# EAGLE design HOMADOS_v1 (EAGLE 9.6.2)
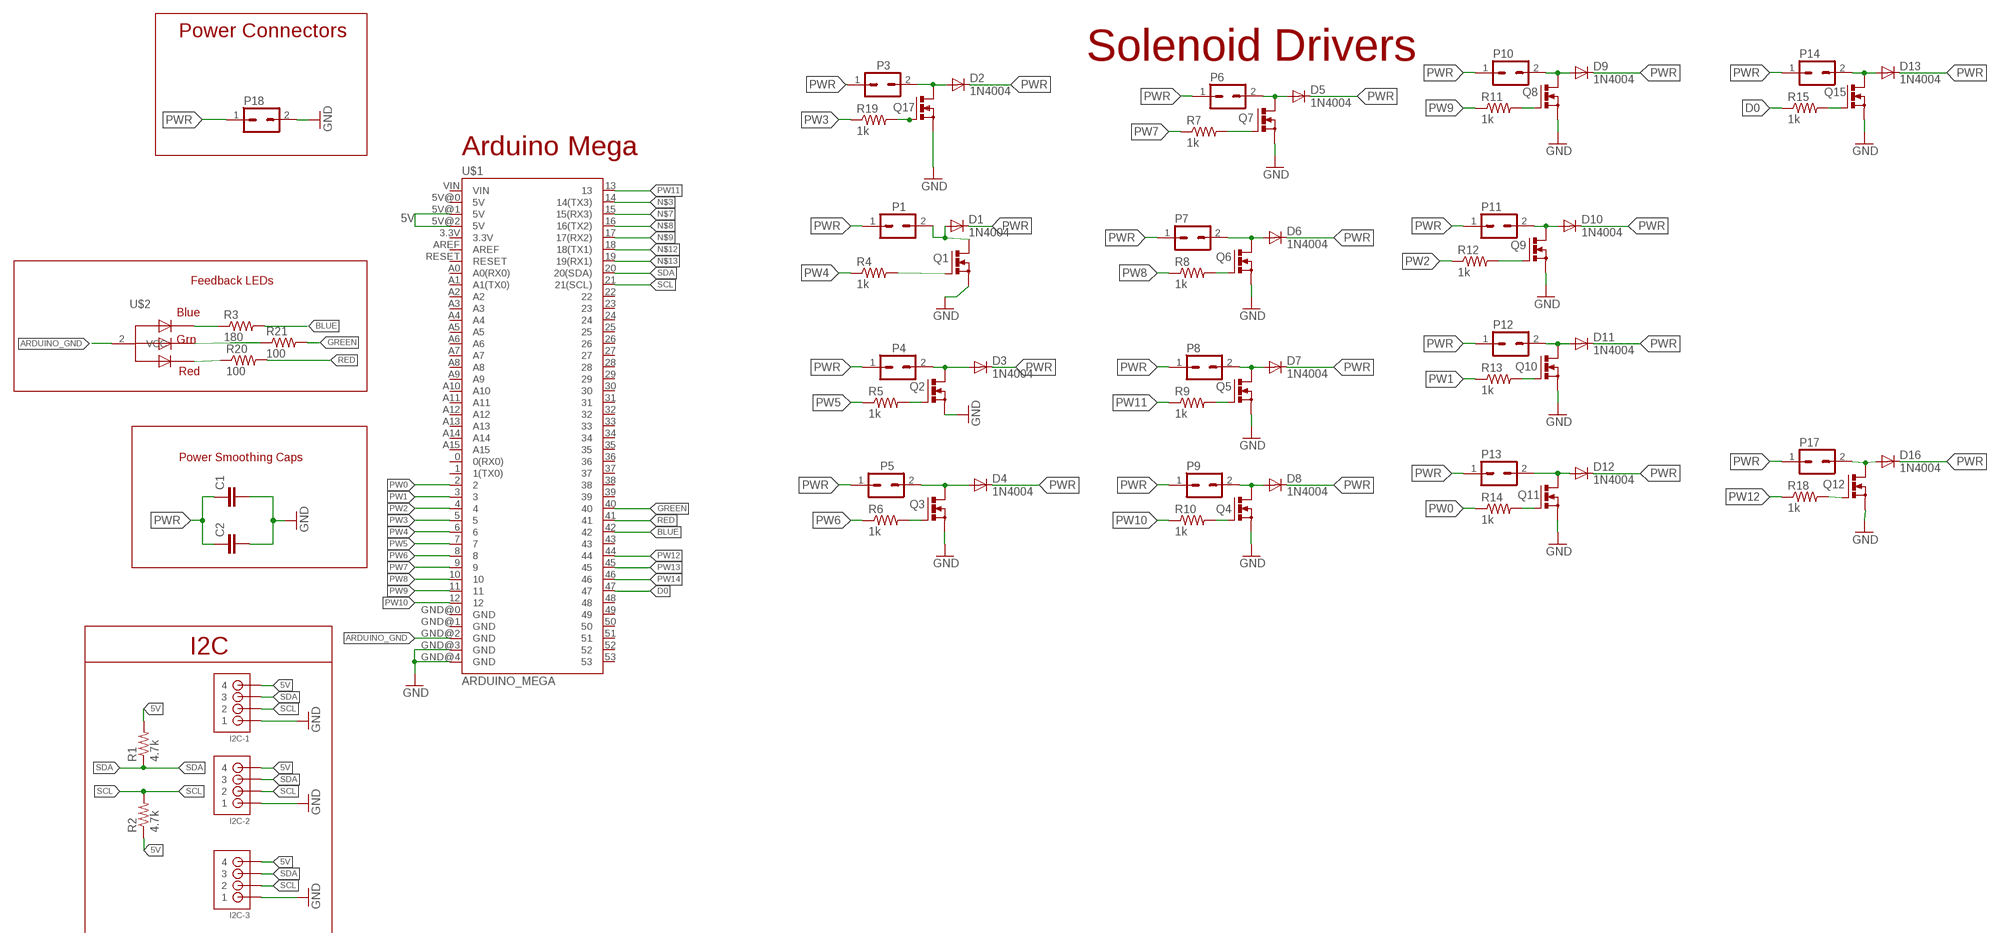
[diagram p0: schematic, sheet 1]

## Parts
C1  CAPPTH1  [CAP-PTH-5MM]
C2  CAPPTH3  [CAP-PTH-LARGE]
D1  1N4004  [DO41-10]
D2  1N4004  [DO41-10]
D3  1N4004  [DO41-10]
D4  1N4004  [DO41-10]
D5  1N4004  [DO41-10]
D6  1N4004  [DO41-10]
D7  1N4004  [DO41-10]
D8  1N4004  [DO41-10]
D9  1N4004  [DO41-10]
D10  1N4004  [DO41-10]
D11  1N4004  [DO41-10]
D12  1N4004  [DO41-10]
D13  1N4004  [DO41-10]
D16  1N4004  [DO41-10]
I2C-1  JST-PH_4-PIN_HEADER  [JST_B4B-PH_HEADER]
I2C-2  JST-PH_4-PIN_HEADER  [JST_B4B-PH_HEADER]
I2C-3  JST-PH_4-PIN_HEADER  [JST_B4B-PH_HEADER]
P1  39-30-02  [39-30-?02?]
P3  39-30-02  [39-30-?02?]
P4  39-30-02  [39-30-?02?]
P5  39-30-02  [39-30-?02?]
P6  39-30-02  [39-30-?02?]
P7  39-30-02  [39-30-?02?]
P8  39-30-02  [39-30-?02?]
P9  39-30-02  [39-30-?02?]
P10  39-30-02  [39-30-?02?]
P11  39-30-02  [39-30-?02?]
P12  39-30-02  [39-30-?02?]
P13  39-30-02  [39-30-?02?]
P14  39-30-02  [39-30-?02?]
P17  39-30-02  [39-30-?02?]
P18  39-30-02  [39-30-?02?]
Q1  PMOSFET_NTO220BV  [TO220BV]
Q2  PMOSFET_NTO220BV  [TO220BV]
Q3  PMOSFET_NTO220BV  [TO220BV]
Q4  PMOSFET_NTO220BV  [TO220BV]
Q5  PMOSFET_NTO220BV  [TO220BV]
Q6  PMOSFET_NTO220BV  [TO220BV]
Q7  PMOSFET_NTO220BV  [TO220BV]
Q8  PMOSFET_NTO220BV  [TO220BV]
Q9  PMOSFET_NTO220BV  [TO220BV]
Q10  PMOSFET_NTO220BV  [TO220BV]
Q11  PMOSFET_NTO220BV  [TO220BV]
Q12  PMOSFET_NTO220BV  [TO220BV]
Q15  PMOSFET_NTO220BV  [TO220BV]
Q17  PMOSFET_NTO220BV  [TO220BV]
R1  4.7k  RESISTORKIT  [AXIAL-0.3-KIT]
R2  4.7k  RESISTORKIT  [AXIAL-0.3-KIT]
R3  180  RESISTORKIT  [AXIAL-0.3-KIT]
R4  1k  RESISTORKIT  [AXIAL-0.3-KIT]
R5  1k  RESISTORKIT  [AXIAL-0.3-KIT]
R6  1k  RESISTORKIT  [AXIAL-0.3-KIT]
R7  1k  RESISTORKIT  [AXIAL-0.3-KIT]
R8  1k  RESISTORKIT  [AXIAL-0.3-KIT]
R9  1k  RESISTORKIT  [AXIAL-0.3-KIT]
R10  1k  RESISTORKIT  [AXIAL-0.3-KIT]
R11  1k  RESISTORKIT  [AXIAL-0.3-KIT]
R12  1k  RESISTORKIT  [AXIAL-0.3-KIT]
R13  1k  RESISTORKIT  [AXIAL-0.3-KIT]
R14  1k  RESISTORKIT  [AXIAL-0.3-KIT]
R15  1k  RESISTORKIT  [AXIAL-0.3-KIT]
R18  1k  RESISTORKIT  [AXIAL-0.3-KIT]
R19  1k  RESISTORKIT  [AXIAL-0.3-KIT]
R20  100  RESISTORKIT  [AXIAL-0.3-KIT]
R21  100  RESISTORKIT  [AXIAL-0.3-KIT]
U$1  ARDUINO_MEGA  [ARDUINO_MEGA]
U$2  RGBLED_CA  [LED5MMRGB]

## Nets
5V: I2C-1.P4 I2C-2.P4 I2C-3.P4 R1.P$2 R2.P$1 U$1.5V@1(5V) U$1.5V@2(5V)
A0: R3.P$1 U$2.4(BLUE)
A2: R20.P$1 U$2.1(RED)
ARDUINO_GND: U$1.GND@2(GND) U$2.2(VCC)
BLUE: R3.P$2 U$1.42
D0: R15.P$1 U$1.47
GND: C1.2 C2.2 I2C-1.P1 I2C-2.P1 I2C-3.P1 P18.2 Q1.S Q2.S Q3.S Q4.S Q5.S Q6.S Q7.S Q8.S Q9.S Q10.S Q11.S Q12.S Q15.S Q17.S U$1.GND@3(GND) U$1.GND@4(GND)
GREEN: R21.P$2 U$1.40
N$1: R21.P$1 U$2.3(GREEN)
N$2: D2.A P3.2 Q17.D
N$3: U$1.14(14(TX3))
N$4: D5.A P6.2 Q7.D
N$5: D12.A P13.2 Q11.D
N$6: Q17.G R19.P$2
N$7: U$1.15(15(RX3))
N$8: U$1.16(16(TX2))
N$9: U$1.17(17(RX2))
N$10: Q1.G R4.P$2
N$11: D13.A P14.2 Q15.D
N$12: U$1.18(18(TX1))
N$13: U$1.19(19(RX1))
N$14: Q2.G R5.P$2
N$15: D1.A P1.2 Q1.D
N$16: D3.A P4.2 Q2.D
N$18: Q3.G R6.P$2
N$19: D4.A P5.2 Q3.D
N$20: D6.A P7.2 Q6.D
N$21: D7.A P8.2 Q5.D
N$22: Q7.G R7.P$2
N$23: D11.A P12.2 Q10.D
N$26: Q6.G R8.P$2
N$27: D8.A P9.2 Q4.D
N$30: Q5.G R9.P$2
N$31: D16.A P17.2 Q12.D
N$33: D10.A P11.2 Q9.D
N$34: Q4.G R10.P$2
N$35: D9.A P10.2 Q8.D
N$38: Q8.G R11.P$2
N$42: Q9.G R12.P$2
N$46: Q10.G R13.P$2
N$50: Q11.G R14.P$2
N$54: Q15.G R15.P$2
N$66: Q12.G R18.P$2
PW0: R14.P$1 U$1.2
PW1: R13.P$1 U$1.3
PW2: R12.P$1 U$1.4
PW3: R19.P$1 U$1.5
PW4: R4.P$1 U$1.6
PW5: R5.P$1 U$1.7
PW6: R6.P$1 U$1.8
PW7: R7.P$1 U$1.9
PW8: R8.P$1 U$1.10
PW9: R11.P$1 U$1.11
PW10: R10.P$1 U$1.12
PW11: R9.P$1 U$1.13
PW12: R18.P$1 U$1.44
PW13: U$1.45
PW14: U$1.46
PWR: C1.1 C2.1 D1.C D2.C D3.C D4.C D5.C D6.C D7.C D8.C D9.C D10.C D11.C D12.C D13.C D16.C P1.1 P3.1 P4.1 P5.1 P6.1 P7.1 P8.1 P9.1 P10.1 P11.1 P12.1 P13.1 P14.1 P17.1 P18.1
RED: R20.P$2 U$1.41
SCL: I2C-1.P2 I2C-2.P2 I2C-3.P2 R2.P$2 U$1.21(21(SCL))
SDA: I2C-1.P3 I2C-2.P3 I2C-3.P3 R1.P$1 U$1.20(20(SDA))
Unconnected: U$1.0(0(RX0)) U$1.1(1(TX0)) U$1.3.3V U$1.5V@0(5V) U$1.22 U$1.23 U$1.24 U$1.25 U$1.26 U$1.27 U$1.28 U$1.29 U$1.30 U$1.31 U$1.32 U$1.33 U$1.34 U$1.35 U$1.36 U$1.37 U$1.38 U$1.39 U$1.43 U$1.48 U$1.49 U$1.50 U$1.51 U$1.52 U$1.53 U$1.A0(A0(RX0)) U$1.A1(A1(TX0)) U$1.A2 U$1.A3 U$1.A4 U$1.A5 U$1.A6 U$1.A7 U$1.A8 U$1.A9 U$1.A10 U$1.A11 U$1.A12 U$1.A13 U$1.A14 U$1.A15 U$1.AREF U$1.GND@0(GND) U$1.GND@1(GND) U$1.RESET U$1.VIN

## Notes on the sheet
- Power Connectors
- Solenoid Drivers
- Arduino Mega
- Feedback LEDs
- Power Smoothing Caps
- I2C

## Library data of the parts
C1 C2 = SparkFun-Passives:CAP: Capacitor Standard 0603 ceramic capacitor, and 0.1" leaded capacitor.
D1-D13 D16 = adafruit:1N4004: DIODE General purpose 1N400x type rectifier (With bigger pads) http://www.ladyada.net/library/pcb/eaglelibrary.html
I2C-1-I2C-3 = JST_connectors:JST-PH_4-PIN_HEADER: 4-pin JST PH Shrouded Header, top entry P/N B4B-PH-K-S Mating connector PHR-4 Mating cable assembly: Sparkfun PRT-09916 <http://www.sparkfun.com/products/9916>
P1 P3-P14 P17 P18 = con-molex-mini-fit:39-30-?02?: HEADER
Q1-Q12 Q15 Q17 = transistor-power:PMOSFET_N: Power MOSFET N-Channel
R1-R15 R18-R21 = SparkFun-Passives:RESISTOR: Resistor Basic schematic elements and footprints for 0603, 1206, and PTH resistors.
U$1 = nathans-custom-parts:ARDUINO_MEGA
U$2 = adafruit:RGBLED_CA: RGB LED, common-anode Staggered pins http://www.ladyada.net/library/pcb/eaglelibrary.html

## Net classes
0 default: width 0.406 mm, drill 0.762 mm, clearance 0.406 mm
1 PWR: width 1.016 mm, drill 0.762 mm, clearance 0.508 mm
2 GND: width 1.016 mm, drill 0.762 mm, clearance 1.016 mm

## Board
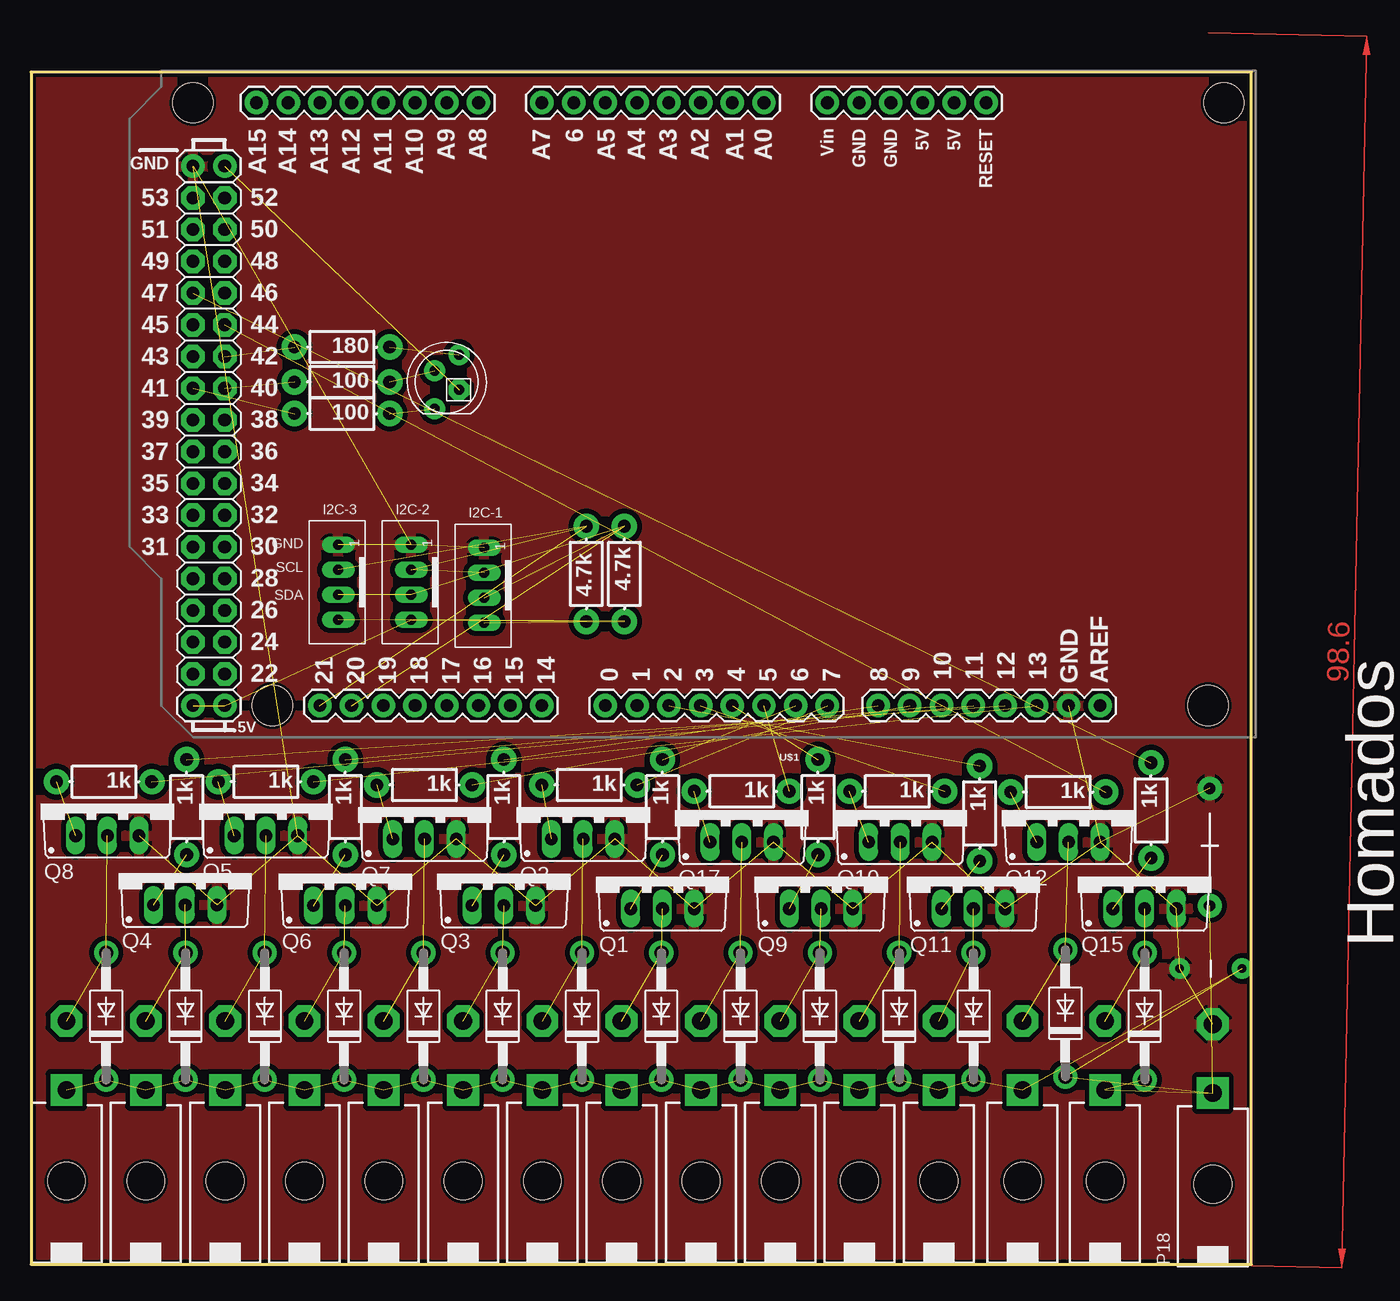
[diagram p1: board, top side]
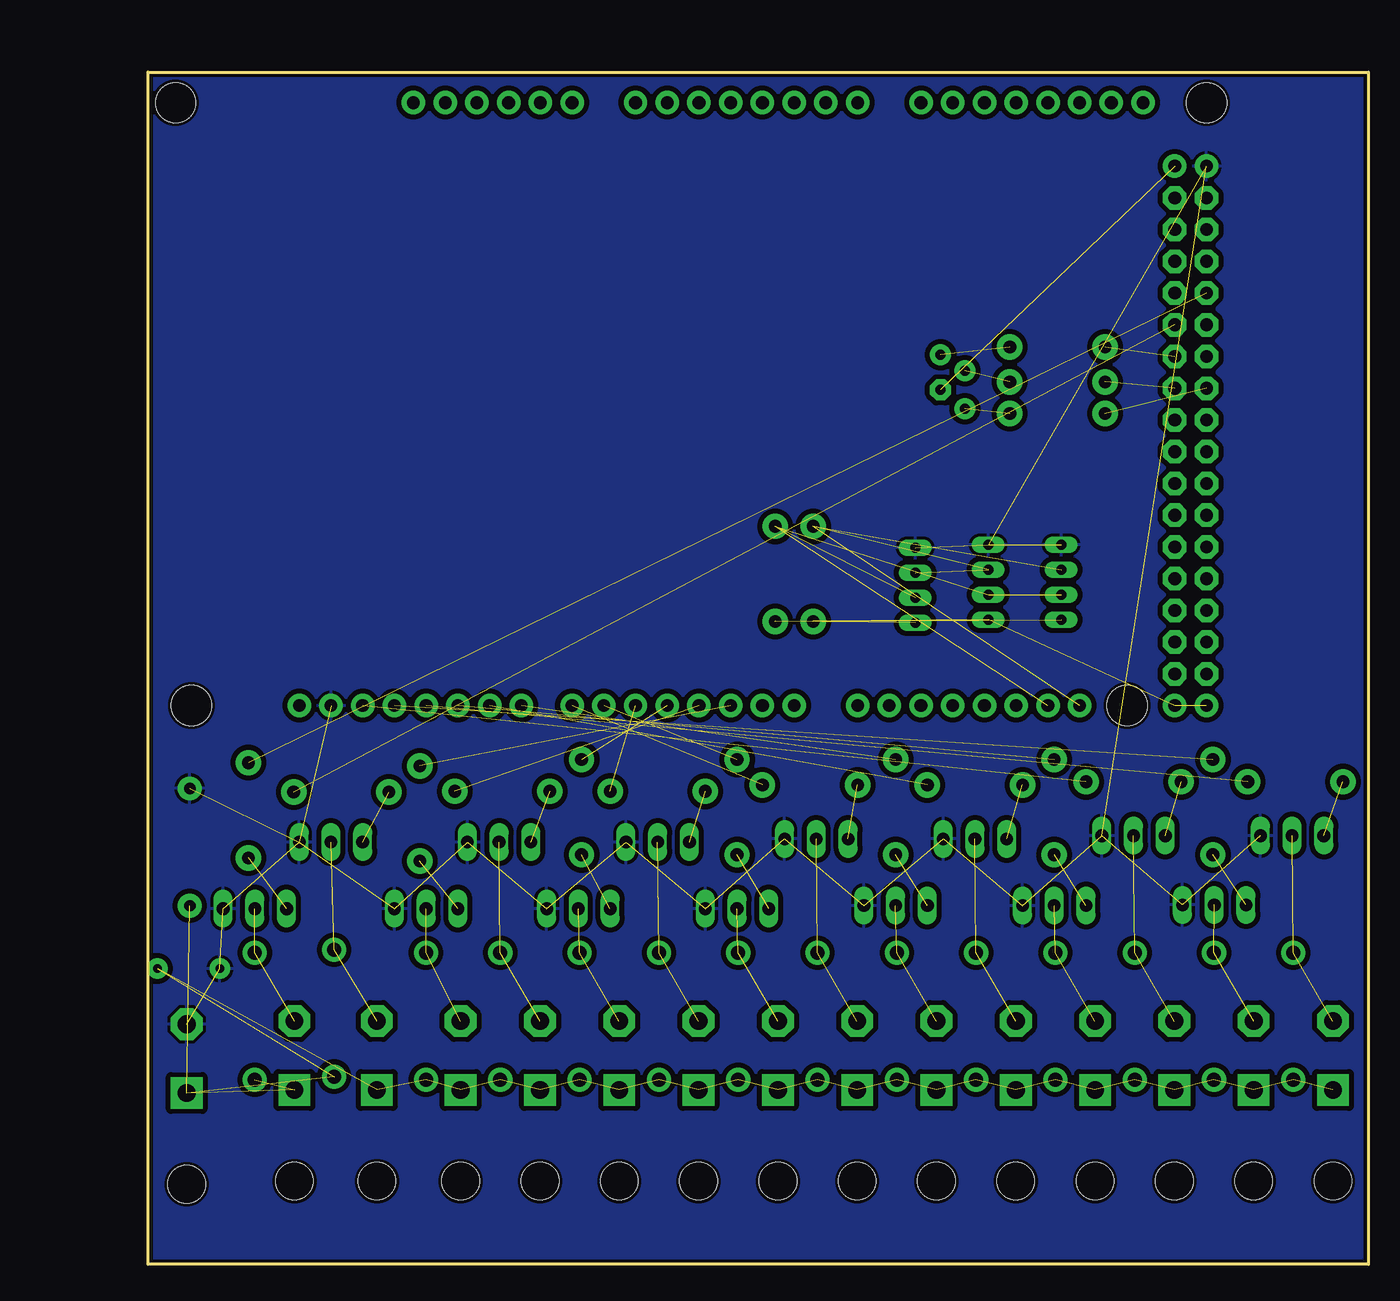
[diagram p2: board, bottom side, seen from below]

Size 97.71 x 95.43 mm. Coordinates in mm from the lower left corner, seen from the top.
Outline: 0,0 97.71,0 97.71,95.43 0,95.43 0,0
Copper layers (1*16): Top 0.035mm / dielectric 1.5mm / Bottom 0.035mm
Design rules "SeeedStudio_2layer_DRU_no_angle_20140221-1": minimum track width 6mil, minimum drill 12mil, track to track 6mil, track to pad 6mil, pad to pad 6mil, via to via 6mil, smd to smd 0mil, copper to edge 10mil, drill to drill 10mil, minimum pad ring 10mil, minimum via ring 6mil, stop-mask expansion 2mil, vias tented up to drill 100mil, thermal gap 10mil

### Footprints (pad centres in the part's own frame; a part is rotated, then mirrored left to right if it is on the bottom)
CAP-PTH-5MM = drill 0.7 pad 1.651: 1 -2.5,0; 2 2.5,0
CAP-PTH-LARGE = drill 0.9 pad 1.905: 1 -4.826,0; 2 4.572,0
DO41-10 = drill 1.118 pad 1.93: A 5.08,0; C -5.08,0
JST_B4B-PH_HEADER = drill 0.8 long: P1 2.98,0.048; P2 0.98,0.048; P3 -1.02,0.048; P4 -3.02,0.048
39-30-?02? = drill 1.422 pad 2.54 square: 1 0,0 | drill 1.422 pad 2.54 octagon: 2 0,5.512 | hole 3: 0,-7.3
TO220BV = drill 1.016 long: D 0,-2.54; G -2.54,-2.54; S 2.54,-2.54
AXIAL-0.3-KIT = drill 1.016 pad 2.032: P$1 -3.81,0; P$2 3.81,0
ARDUINO_MEGA = drill 1.016 pad 1.88: 0 13.97,24.13; 1 11.43,24.13; 2 8.89,24.13; 3 6.35,24.13; 3.3V -13.97,-24.13; 4 3.81,24.13; 5 1.27,24.13; 5V@0 -11.43,-24.13; 5V@1 44.45,24.13; 5V@2 46.99,24.13; 6 -1.27,24.13; 7 -3.81,24.13; 8 -7.874,24.13; 9 -10.414,24.13; 10 -12.954,24.13; 11 -15.494,24.13; 12 -18.034,24.13; 13 -20.574,24.13; 14 19.05,24.13; 15 21.59,24.13; 16 24.13,24.13; 17 26.67,24.13; 18 29.21,24.13; 19 31.75,24.13; 20 34.29,24.13; 21 36.83,24.13; A0 1.27,-24.13; A1 3.81,-24.13; A2 6.35,-24.13; A3 8.89,-24.13; A4 11.43,-24.13; A5 13.97,-24.13; A6 16.51,-24.13; A7 19.05,-24.13; A8 24.13,-24.13; A9 26.67,-24.13; A10 29.21,-24.13; A11 31.75,-24.13; A12 34.29,-24.13; A13 36.83,-24.13; A14 39.37,-24.13; A15 41.91,-24.13; AREF -25.654,24.13; GND@0 -8.89,-24.13; GND@1 -6.35,-24.13; GND@2 44.45,-19.05; GND@3 46.99,-19.05; GND@4 -23.114,24.13; RESET -16.51,-24.13; VIN -3.81,-24.13 | drill 1.016 pad 1.88 octagon: 22 44.45,21.59; 23 46.99,21.59; 24 44.45,19.05; 25 46.99,19.05; 26 44.45,16.51; 27 46.99,16.51; 28 44.45,13.97; 29 46.99,13.97; 30 44.45,11.43; 31 46.99,11.43; 32 44.45,8.89; 33 46.99,8.89; 34 44.45,6.35; 35 46.99,6.35; 36 44.45,3.81; 37 46.99,3.81; 38 44.45,1.27; 39 46.99,1.27; 40 44.45,-1.27; 41 46.99,-1.27; 42 44.45,-3.81; 43 46.99,-3.81; 44 44.45,-6.35; 45 46.99,-6.35; 46 44.45,-8.89; 47 46.99,-8.89; 48 44.45,-11.43; 49 46.99,-11.43; 50 44.45,-13.97; 51 46.99,-13.97; 52 44.45,-16.51; 53 46.99,-16.51 | hole 3.2: -34.29,24.13; -35.56,-24.13; 40.64,24.13; 46.99,-24.13
LED5MMRGB = drill 0.8 pad 1.676: 1 -2.159,0.968; 3 0.889,0.968; 4 2.159,-0.968 | drill 0.8 pad 1.676 octagon: 2 -0.635,-0.968

### Placement (x,y rotation side)
C1  94.45,23.68 180 top
C2  94.36,33.53 90 top
D1  50.45,19.86 90 top
D2  56.8,19.86 90 top
D3  44.1,19.86 90 top
D4  37.75,19.86 90 top
D5  31.4,19.86 90 top
D6  25.05,19.86 90 top
D7  18.7,19.86 90 top
D8  12.35,19.86 90 top
D9  6,19.86 90 top
D10  63.15,19.86 90 top
D11  69.5,19.86 90 top
D12  75.45,19.86 90 top
D13  89.16,19.86 90 top
D16  82.8,20.11 90 top
I2C-1  36.32,54.38 90 top
I2C-2  30.48,54.64 90 top
I2C-3  24.64,54.64 90 top
P1  39-30-02?  [39-30-?02?]  47.28,13.97 0 top
P3  39-30-02?  [39-30-?02?]  53.63,13.97 0 top
P4  39-30-02?  [39-30-?02?]  40.93,13.97 0 top
P5  39-30-02?  [39-30-?02?]  34.58,13.97 0 top
P6  39-30-02?  [39-30-?02?]  28.23,13.97 0 top
P7  39-30-02?  [39-30-?02?]  21.88,13.97 0 top
P8  39-30-02?  [39-30-?02?]  15.53,13.97 0 top
P9  39-30-02?  [39-30-?02?]  9.18,13.97 0 top
P10  39-30-02?  [39-30-?02?]  2.83,13.97 0 top
P11  39-30-02?  [39-30-?02?]  59.98,13.97 0 top
P12  39-30-02?  [39-30-?02?]  66.33,13.97 0 top
P13  39-30-02?  [39-30-?02?]  72.68,13.97 0 top
P14  39-30-02?  [39-30-?02?]  85.98,13.97 0 top
P17  39-30-02?  [39-30-?02?]  79.38,13.97 0 top
P18  39-30-02?  [39-30-?02?]  94.62,13.72 0 top
Q1  50.55,31.02 0 top
Q2  44.2,36.6 0 top
Q3  37.85,31.27 0 top
Q4  12.33,31.31 0 top
Q5  18.8,36.86 0 top
Q6  25.15,31.27 0 top
Q7  31.5,36.6 0 top
Q8  6.1,36.86 0 top
Q9  63.25,31.02 0 top
Q10  69.6,36.35 0 top
Q11  75.44,31.02 0 top
Q12  83.06,36.35 0 top
Q15  89.15,31.02 0 top
Q17  56.9,36.35 0 top
R1  47.5,55.27 270 top
R2  44.45,55.27 90 top
R3  24.89,73.43 180 top
R4  50.55,36.6 270 top
R5  44.7,38.38 180 top
R6  37.85,36.6 270 top
R7  31.5,38.38 180 top
R8  25.15,36.6 270 top
R9  18.8,38.64 180 top
R10  12.45,36.6 270 top
R11  5.84,38.64 180 top
R12  62.99,36.6 270 top
R13  69.34,37.87 180 top
R14  75.95,36.1 270 top
R15  89.66,36.35 270 top
R18  82.23,37.81 180 top
R19  56.9,37.87 180 top
R20  24.89,68.1 180 top
R21  24.89,70.64 180 top
U$1  59.94,68.86 180 top
U$2  33.27,70.64 90 top

### Tracks (layer width: path | path; a pad name or v marks a point on that pad's centre or on a via)
5V  (6 unrouted)
A0  (1 unrouted)
A2  (1 unrouted)
ARDUINO_GND  (1 unrouted)
BLUE  (1 unrouted)
D0  (1 unrouted)
GND  (21 unrouted)
  pour Top: -2.29,95.53 98.08,95.53 98.08,-0.15 -2.29,-0.75
  pour Bottom: -2.22,95.21 98.08,95.46 98.08,0 -2.76,0
GREEN  (1 unrouted)
N$1  (1 unrouted)
N$2  (2 unrouted)
N$4  (2 unrouted)
N$5  (2 unrouted)
N$6  (1 unrouted)
N$10  (1 unrouted)
N$11  (2 unrouted)
N$14  (1 unrouted)
N$15  (2 unrouted)
N$16  (2 unrouted)
N$18  (1 unrouted)
N$19  (2 unrouted)
N$20  (2 unrouted)
N$21  (2 unrouted)
N$22  (1 unrouted)
N$23  (2 unrouted)
N$26  (1 unrouted)
N$27  (2 unrouted)
N$30  (1 unrouted)
N$31  (2 unrouted)
N$33  (2 unrouted)
N$34  (1 unrouted)
N$35  (2 unrouted)
N$38  (1 unrouted)
N$42  (1 unrouted)
N$46  (1 unrouted)
N$50  (1 unrouted)
N$54  (1 unrouted)
N$66  (1 unrouted)
PW0  (1 unrouted)
PW1  (1 unrouted)
PW2  (1 unrouted)
PW3  (1 unrouted)
PW4  (1 unrouted)
PW5  (1 unrouted)
PW6  (1 unrouted)
PW7  (1 unrouted)
PW8  (1 unrouted)
PW9  (1 unrouted)
PW10  (1 unrouted)
PW11  (1 unrouted)
PW12  (1 unrouted)
PWR  (30 unrouted)
RED  (1 unrouted)
SCL  (4 unrouted)
SDA  (4 unrouted)
(copper drawn outside any net)
  shapes: Top area x1

### Text on the board
tNames: 5v | rev 2.0 | GND | SCL | SDA | Homados | Designed by / Nathan VIllicana-Shaw | Spring 2017